# Altium project Cum LED v2.PrjPcb
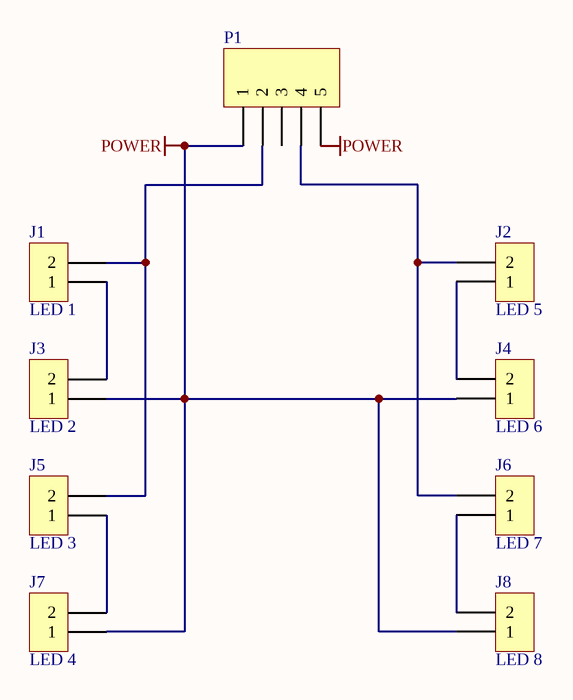
[diagram p0: Cum LED v2.SchDoc]
1 sheet, 9 parts. Net scope: global (net labels, ports and power ports of the same name join across sheets).
Board file: Cum LED v2 Ghep.PcbDoc

## Sheet Cum LED v2.SchDoc
size A

### Parts
J1  value LED 1  [LED OSRAM CIRCUIT]
J2  value LED 5  [LED OSRAM CIRCUIT]
J3  value LED 2  [LED OSRAM CIRCUIT]
J4  value LED 6  [LED OSRAM CIRCUIT]
J5  value LED 3  [LED OSRAM CIRCUIT]
J6  value LED 7  [LED OSRAM CIRCUIT]
J7  value LED 4  [LED OSRAM CIRCUIT]
J8  value LED 8  [LED OSRAM CIRCUIT]
P1  Jump đực loại thẳng, 2.54mm 5P  [HDR1X5]  (value not drawn)

### Nets
POWER: J3.1 J4.1 J7.1 J8.1 P1.1 P1.5
NetJ1_1: J1.1 J3.2
NetJ1_2: J1.2 J5.2 P1.2
NetJ2_1: J2.1 J4.2
NetJ2_2: J2.2 J6.2 P1.4
NetJ5_1: J5.1 J7.2
NetJ6_1: J6.1 J8.2

Not connected (* = marked no-connect by the designer): P1 3

### Library data of the parts
J1-J8 = CON2: Type1: Giắc xanh loại nằm, 300V/16A - 5.08mm; Type2: Jump đực loại thẳng, 2.54mm; Type3: Jumper; Type4: Giắc xanh loại nằm, 300V/16A - 3.81mm; Type5: Jump đực loại cong, 2.54mm
P1 = Header 5: Header, 5-Pin; LatestRevisionDate: 17-Jul-2002; LatestRevisionNote: Re-released for DXP Platform.; Publisher: Altium Limited